# Altium schematic sheet MIL_STD_1275D.SchDoc: MIL-STD-1275D_PROTECTION (part 4 of 4)
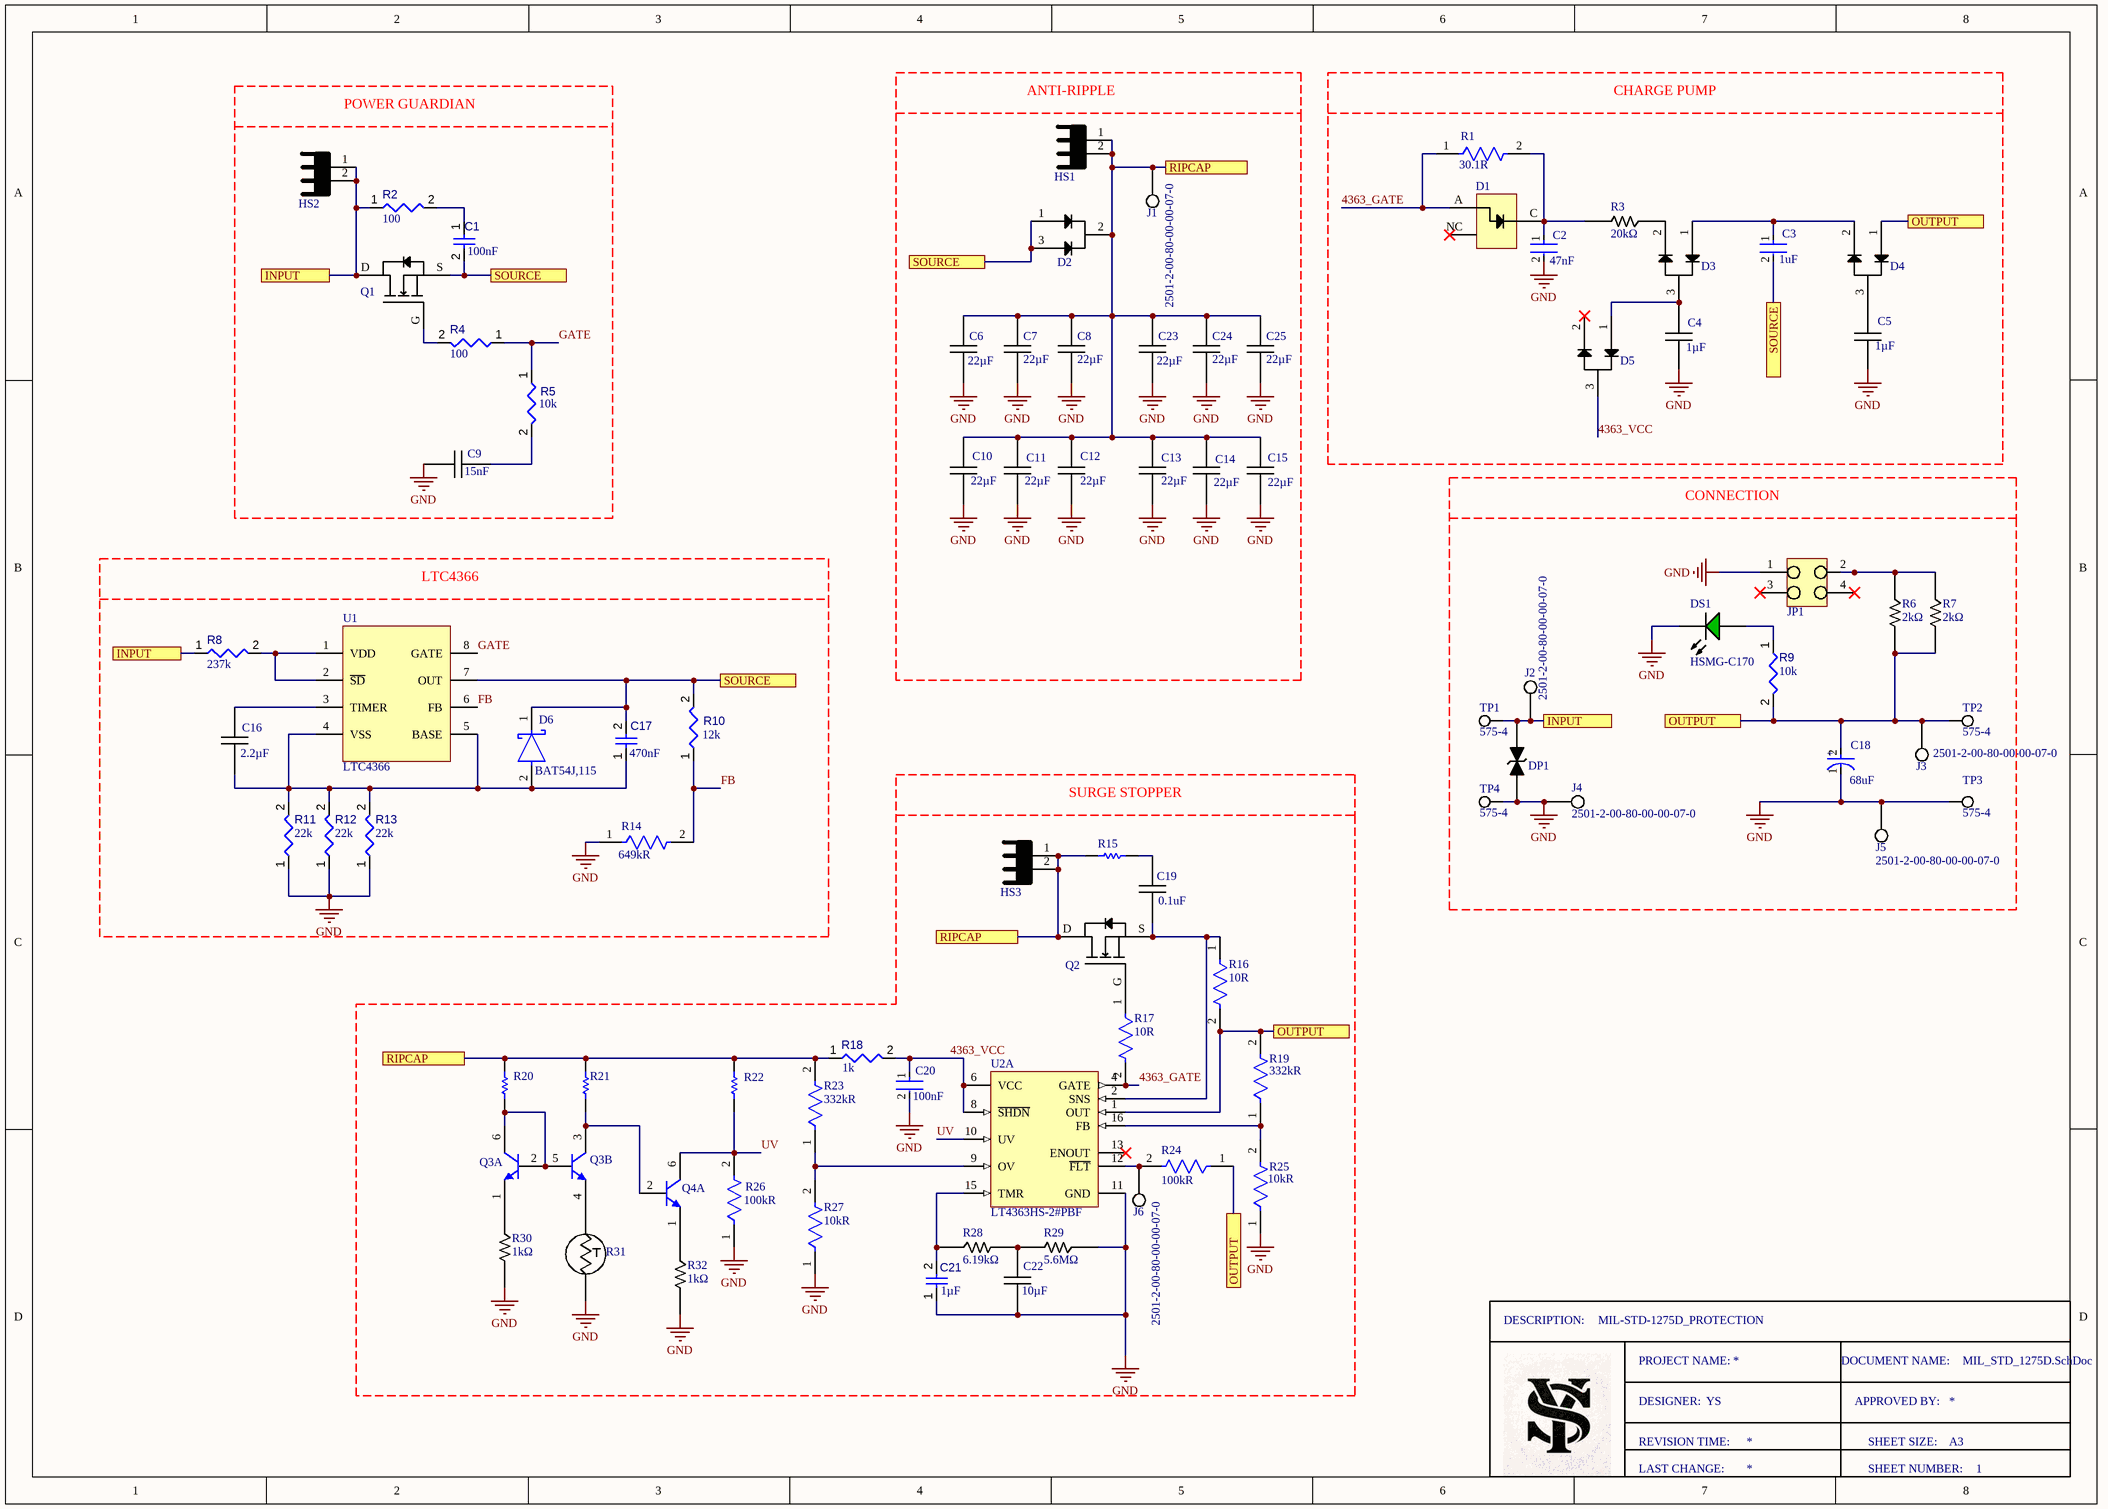
[diagram p3: MIL_STD_1275D.SchDoc]

## Library data of the parts (continued)
U2 = CMP-0474-00654-1: High Voltage Surge Stopper with Current Limit, 4 to 80 V Vin, 16-pin SOP (S-16), -40 to 125 degC, Pb-Free; Manufacturer: Linear Technology; Vin Range: 4 to 80 V; Circuit Breaker Threshold: 50 mV; Extended Temp: C, I, H, MP; Active Limiting: yes; Circuit Breaker Accuracy(%): 14; PackageReference: S-16; ComponentLink2URL: http://cds.linear.com/docs/en/datasheet/4363fb.pdf; Mounting Technology: Surface Mount; ComponentLink3Description: Package Specification; PackageVersion: Rev. G, 05/2012; ComponentLink1Description: Manufacturer URL; DatasheetVersion: Rev. B; Fault: yes; ComponentLink1URL: http://www.linear.com/; RoHS: TRUE; PackageDescription: 16-Pin Plastic Small Outline, Body 9.9 x 3.9 mm, Pitch 1.27 mm; Foldback: yes; ComponentLink3URL: http://cds.linear.com/docs/en/packaging/S16%2005-08-1610%20Rev%20G.pdf; ComponentLink2Description: Datasheet; Fast Comparator: yes; PartNumber: LT4363HS-2#PBF